# Altium project SVFC.PrjPcb (part 7 of 10)

## Sheet SFPGA_power.SchDoc: System FPGA
size 297 x 209 mm; CheckedBy: T.Janicki; CompanyName: Creotech Instruments SA; DrawnBy: G.Kasprowicz; Organization: CERN; Address1: European Organization for Nuclear Research; Address2: CH-1211 Geneve 23 - Switzerland; DocumentNumber: 9; Revision: -; SheetNumber: 9; SheetTotal: 17; EDA_Number: EDA-xxxx; Projet: Simple VME FMC Carrier; ModifiedBy: TW, MC; CreateDate: 20/11/2012; CheckedDate: 23/01/2012; Title2: Power supplies; DivGrp: BE-CO; Designer: G.Kasprowicz; DocumentName: fpga_power.SchDoc; ModifiedDate: -
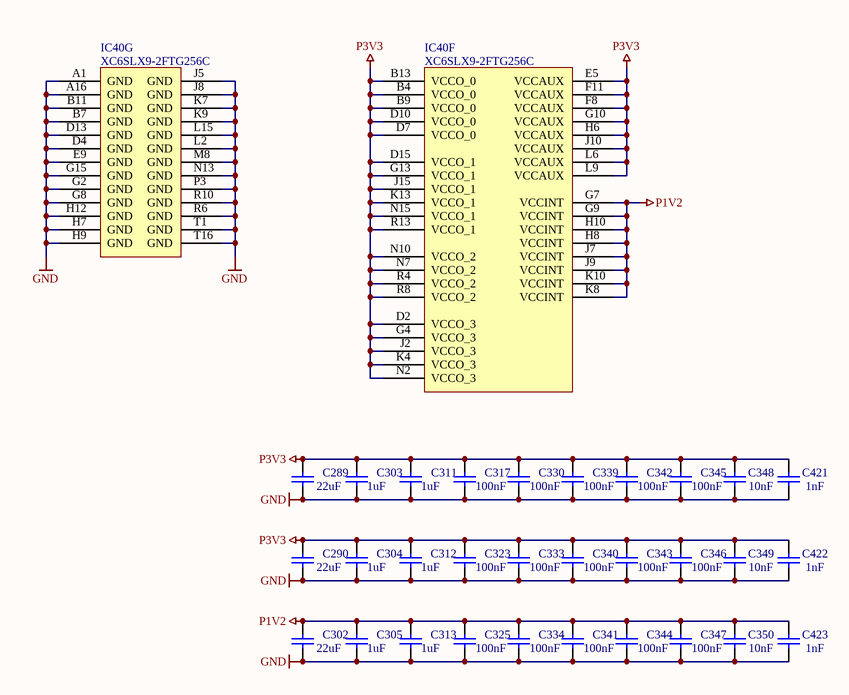
[diagram p14: SFPGA_power.SchDoc]

### Parts
C289  22uF  [CAPC3216X180N]
C290  22uF  [CAPC3216X180N]
C302  22uF  [CAPC3216X180N]
C303  1uF  [CAPC1608X87N]
C304  1uF  [CAPC1608X87N]
C305  1uF  [CAPC1608X87N]
C311  1uF  [CAPC1608X87N]
C312  1uF  [CAPC1608X87N]
C313  1uF  [CAPC1608X87N]
C317  100nF  [CAPC1005X55N]
C323  100nF  [CAPC1005X55N]
C325  100nF  [CAPC1005X55N]
C330  100nF  [CAPC1005X55N]
C333  100nF  [CAPC1005X55N]
C334  100nF  [CAPC1005X55N]
C339  100nF  [CAPC1005X55N]
C340  100nF  [CAPC1005X55N]
C341  100nF  [CAPC1005X55N]
C342  100nF  [CAPC1005X55N]
C343  100nF  [CAPC1005X55N]
C344  100nF  [CAPC1005X55N]
C345  100nF  [CAPC1005X55N]
C346  100nF  [CAPC1005X55N]
C347  100nF  [CAPC1005X55N]
C348  10nF  [CAPC1608X87N]
C349  10nF  [CAPC1608X87N]
C350  10nF  [CAPC1608X87N]
C421  1nF  [CAPC1005X55N]
C422  1nF  [CAPC1005X55N]
C423  1nF  [CAPC1005X55N]
IC40  XC6SLX9-2FTG256C  [BGA256C100P16X16_1700X1700X155]  (parts F,G of 7)

### Nets
GND: C289.1 C290.1 C302.1 C303.1 C304.1 C305.1 C311.1 C312.1 C313.1 C317.1 C323.1 C325.1 C330.1 C333.1 C334.1 C339.1 C340.1 C341.1 C342.1 C343.1 C344.1 C345.1 C346.1 C347.1 C348.1 C349.1 C350.1 C421.1 C422.1 C423.1 IC40.A1(GND) IC40.A16(GND) IC40.B7(GND) IC40.B11(GND) IC40.D4(GND) IC40.D13(GND) IC40.E9(GND) IC40.G2(GND) IC40.G8(GND) IC40.G15(GND) IC40.H7(GND) IC40.H9(GND) IC40.H12(GND) IC40.J5(GND) IC40.J8(GND) IC40.K7(GND) IC40.K9(GND) IC40.L2(GND) IC40.L15(GND) IC40.M8(GND) IC40.N13(GND) IC40.P3(GND) IC40.R6(GND) IC40.R10(GND) IC40.T1(GND) IC40.T16(GND)
P1V2: C302.2 C305.2 C313.2 C325.2 C334.2 C341.2 C344.2 C347.2 C350.2 C423.2 IC40.G7(VCCINT) IC40.G9(VCCINT) IC40.H8(VCCINT) IC40.H10(VCCINT) IC40.J7(VCCINT) IC40.J9(VCCINT) IC40.K8(VCCINT) IC40.K10(VCCINT)
P3V3: C289.2 C290.2 C303.2 C304.2 C311.2 C312.2 C317.2 C323.2 C330.2 C333.2 C339.2 C340.2 C342.2 C343.2 C345.2 C346.2 C348.2 C349.2 C421.2 C422.2 IC40.B4(VCCO_0) IC40.B9(VCCO_0) IC40.B13(VCCO_0) IC40.D2(VCCO_3) IC40.D7(VCCO_0) IC40.D10(VCCO_0) IC40.D15(VCCO_1) IC40.E5(VCCAUX) IC40.F8(VCCAUX) IC40.F11(VCCAUX) IC40.G4(VCCO_3) IC40.G10(VCCAUX) IC40.G13(VCCO_1) IC40.H6(VCCAUX) IC40.J2(VCCO_3) IC40.J10(VCCAUX) IC40.J15(VCCO_1) IC40.K4(VCCO_3) IC40.K13(VCCO_1) IC40.L6(VCCAUX) IC40.L9(VCCAUX) IC40.N2(VCCO_3) IC40.N7(VCCO_2) IC40.N10(VCCO_2) IC40.N15(VCCO_1) IC40.R4(VCCO_2) IC40.R8(VCCO_2) IC40.R13(VCCO_1)

### Notes on the sheet
- Project/Equipment
- Document
- Designer
- Drawn by
- Check.by
- File
- Last Mod.
- Print Date
- Sheet
- Size
- A4
- of
- Rev

### Library data of the parts
C289 C290 C302 = CC1206_22UF_10V_10%_X7R: Non-polarised capacitor; Part Description: SMD Multilayer Chip Ceramic Capacitor; Manufacturer: GENERIC; Manufacturer1 Part Number: GRM31CR71A226KE15L; Voltage: 10V; TC: X7R; Tolerance: ±10%; Table: Capacitors SMD; Part Number: CC1206_22UF_10V_10%_X7R; Component Kind: Standard; Component Type: Standard; Pin Count: 2; Value: 22uF; Status: Preferred; Manufacturer Part Number: CC1206_22UF_10V_10%_X7R; Case: 1206; Mounted: Yes; Socket: No; SMD: Yes; Manufacturer1 Example: MURATA; Manufacturer1 ComponentHeight: 1.8mm; HelpURL: \\cern.ch\dfs\Applications\Altium\Datasheets\CC1206_X7R_MURATA_GRM-HI-CAP.pdf; Author: CERN DEM JLC; CreateDate: 2010-06-08; LatestRevisionDate: 2010-06-08
C303-C305 C311-C313 = CC0603_1UF_16V_10%_X7R: Non-polarised capacitor; Part Description: SMD Multilayer Chip Ceramic Capacitor; Manufacturer: GENERIC; Manufacturer1 Part Number: 223824613663; Voltage: 16V; TC: X7R; Tolerance: ±10%; Table: Capacitors SMD; Part Number: CC0603_1UF_16V_10%_X7R; Component Kind: Standard; Component Type: Standard; Pin Count: 2; Value: 1uF; Status: Preferred; Manufacturer Part Number: CC0603_1uF_16V_10%_X7R; Case: 0603; Mounted: Yes; Socket: No; SMD: Yes; Manufacturer1 Example: PHYCOMP; Manufacturer1 ComponentHeight: 0.87mm; HelpURL: \\cern.ch\dfs\Applications\Altium\Datasheets\CC0805_X5R_PHYCOMP_HC.pdf; Author: CERN DEM JLC; CreateDate: 03/12/2007; LatestRevisionDate: 03/12/2007
C317 C323 C325 C330 C333 C334 C339-C347 = CC0402_100NF_16V_10%_X7R: Non-polarised capacitor; Part Description: SMD Multilayer Chip Ceramic Capacitor; Manufacturer: GENERIC; Manufacturer1 Part Number: 223878715649; Voltage: 16V; TC: X7R; Tolerance: ±10%; Table: Capacitors SMD; Part Number: CC0402_100NF_16V_10%_X7R; Component Kind: Standard; Component Type: Standard; Pin Count: 2; Value: 100nF; Status: Not Recommended; Manufacturer Part Number: CC0402_100NF_16V_10%_X7R; Case: 0402; Mounted: Yes; Socket: No; SMD: Yes; Manufacturer1 Example: PHYCOMP; Manufacturer1 ComponentHeight: 0.55mm; HelpURL: \\cern.ch\dfs\Applications\Altium\Datasheets\CC0402_X7R_PHYCOMP.pdf; Author: CERN DEM JLC; CreateDate: 03/12/2007; LatestRevisionDate: 03/12/2007
C348-C350 = CC0603_10NF_50V_10%_X7R: Non-polarised capacitor; Part Description: SMD Multilayer Chip Ceramic Capacitor; Manufacturer: GENERIC; Manufacturer1 Part Number: 223858615636; Voltage: 50V; TC: X7R; Tolerance: ±10%; Table: Capacitors SMD; Part Number: CC0603_10NF_50V_10%_X7R; Component Kind: Standard; Component Type: Standard; Pin Count: 2; Value: 10nF; Status: Preferred; Manufacturer Part Number: CC0603_10NF_50V_10%_X7R; Case: 0603; Mounted: Yes; Socket: No; SMD: Yes; Manufacturer1 Example: PHYCOMP; Manufacturer1 ComponentHeight: 0.87mm; HelpURL: \\cern.ch\dfs\Applications\Altium\Datasheets\CC0603_X7R_PHYCOMP.pdf; Author: CERN DEM JLC; CreateDate: 03/12/2007; LatestRevisionDate: 03/12/2007
C421-C423 = CC0402_1NF_50V_10%_X7R: Non-polarised capacitor; Part Description: SMD Multilayer Chip Ceramic Capacitor; Manufacturer: GENERIC; Manufacturer1 Part Number: 223858715623; Voltage: 50V; TC: X7R; Tolerance: ±10%; Table: Capacitors SMD; Part Number: CC0402_1NF_50V_10%_X7R; Component Kind: Standard; Component Type: Standard; Pin Count: 2; Value: 1nF; Status: Not Recommended; Manufacturer Part Number: CC0402_1NF_50V_10%_X7R; Case: 0402; Mounted: Yes; Socket: No; SMD: Yes; Manufacturer1 Example: PHYCOMP; Manufacturer1 ComponentHeight: 0.55mm; HelpURL: \\cern.ch\dfs\Applications\Altium\Datasheets\CC0402_X7R_PHYCOMP.pdf; Author: CERN DEM JLC; CreateDate: 03/12/2007; LatestRevisionDate: 03/12/2007
IC40 = XC6SLX9-2FTG256C: Spartan-6 LX 1.2V FPGA, 186 User I/Os, 256-Ball Fine-Pitch Thin BGA (1.0mm Pitch), Speed Grade 2, Commercial Grade, Pb-Free; Manufacturer: XILINX; Table: Logic; Part Number: XC6SLX9-2FTG256C; Component Kind: Standard; Component Type: Standard; Device: XC6SLX9-2FTG256C; PackageDescription: BGA 1mm, Pitch, Square 256 Pin, 16 Columns x 16 Rows, Body 17mm X 17mm X 1.55mm H; Part Description: Spartan-6 LX 1.2V FPGA, 186 User I/Os, 256-Ball Fine-Pitch Thin BGA (1.0mm Pitch), Speed Grade 2, Commercial Grade, Pb-Free; Manufacturer Part Number: XC6SLX9-2FTG256C; Pin Count: 256; Case: BGA256; Mounted: Yes; Socket: No; SMD: Yes; ComponentHeight: 1.55mm; HelpURL: \\cern.ch\dfs\Applications\Altium\Datasheets\XC6SLX9-2FTG256C.pdf; ComponentLink1URL: \\cern.ch\dfs\Applications\Altium\Datasheets\XC6SLX9-2FTG256C_Package-Pinout.pdf; ComponentLink1Description: Package/Pinouts; Author: CERN DEM JLC; CreateDate: 2011-11-01; LatestRevisionDate: 2011-11-01

## Sheet AFPGA_power.SchDoc: Application FPGA
size 297 x 209 mm; CheckedBy: T.Janicki; CompanyName: Creotech Instruments SA; DrawnBy: G.Kasprowicz; Organization: CERN; Address1: European Organization for Nuclear Research; Address2: CH-1211 Geneve 23 - Switzerland; DocumentNumber: 9; Revision: -; SheetNumber: 9; SheetTotal: 17; EDA_Number: EDA-xxxx; Projet: Simple VME FMC Carrier; CreateDate: 20/11/2012; CheckedDate: 23/01/2012; Title2: Power supplies; DivGrp: BE-CO; Designer: G.Kasprowicz; DocumentName: fpga_power.SchDoc; ModifiedDate: -
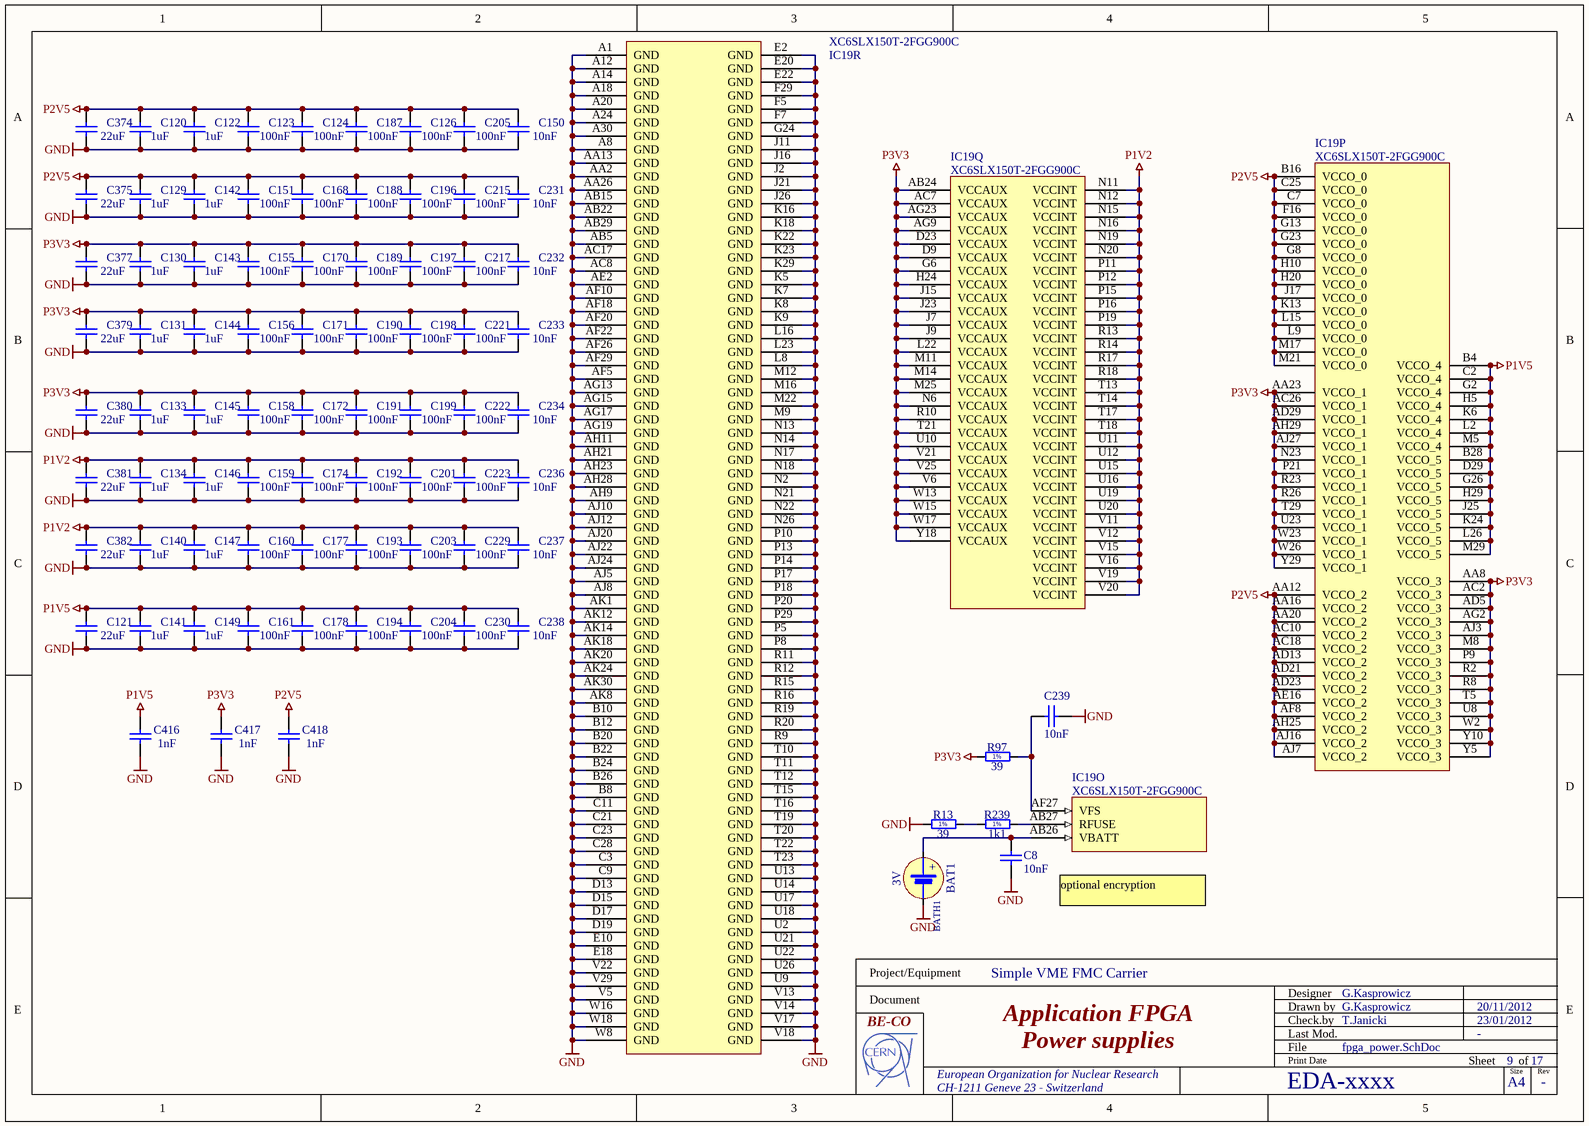
[diagram p15: AFPGA_power.SchDoc]

### Parts
BAT1  3V  [BAT_VARTA_CR2025]
BATH1  (no value)  [BATH_KEYSTONE_103]
C8  10nF  [CAPC1608X87N]
C120  1uF  [CAPC1608X87N]
C121  22uF  [CAPC3216X180N]
C122  1uF  [CAPC1608X87N]
C123  100nF  [CAPC1005X55N]
C124  100nF  [CAPC1005X55N]
C126  100nF  [CAPC1005X55N]
C129  1uF  [CAPC1608X87N]
C130  1uF  [CAPC1608X87N]
C131  1uF  [CAPC1608X87N]
C133  1uF  [CAPC1608X87N]
C134  1uF  [CAPC1608X87N]
C140  1uF  [CAPC1608X87N]
C141  1uF  [CAPC1608X87N]
C142  1uF  [CAPC1608X87N]
C143  1uF  [CAPC1608X87N]
C144  1uF  [CAPC1608X87N]
C145  1uF  [CAPC1608X87N]
C146  1uF  [CAPC1608X87N]
C147  1uF  [CAPC1608X87N]
C149  1uF  [CAPC1608X87N]
C150  10nF  [CAPC1608X87N]
C151  100nF  [CAPC1005X55N]
C155  100nF  [CAPC1005X55N]
C156  100nF  [CAPC1005X55N]
C158  100nF  [CAPC1005X55N]
C159  100nF  [CAPC1005X55N]
C160  100nF  [CAPC1005X55N]
C161  100nF  [CAPC1005X55N]
C168  100nF  [CAPC1005X55N]
C170  100nF  [CAPC1005X55N]
C171  100nF  [CAPC1005X55N]
C172  100nF  [CAPC1005X55N]
C174  100nF  [CAPC1005X55N]
C177  100nF  [CAPC1005X55N]
C178  100nF  [CAPC1005X55N]
C187  100nF  [CAPC1005X55N]
C188  100nF  [CAPC1005X55N]
C189  100nF  [CAPC1005X55N]
C190  100nF  [CAPC1005X55N]
C191  100nF  [CAPC1005X55N]
C192  100nF  [CAPC1005X55N]
C193  100nF  [CAPC1005X55N]
C194  100nF  [CAPC1005X55N]
C196  100nF  [CAPC1005X55N]
C197  100nF  [CAPC1005X55N]
C198  100nF  [CAPC1005X55N]
C199  100nF  [CAPC1005X55N]
C201  100nF  [CAPC1005X55N]
C203  100nF  [CAPC1005X55N]
C204  100nF  [CAPC1005X55N]
C205  100nF  [CAPC1005X55N]
C215  100nF  [CAPC1005X55N]
C217  100nF  [CAPC1005X55N]
C221  100nF  [CAPC1005X55N]
C222  100nF  [CAPC1005X55N]
C223  100nF  [CAPC1005X55N]
C229  100nF  [CAPC1005X55N]
C230  100nF  [CAPC1005X55N]
C231  10nF  [CAPC1608X87N]
C232  10nF  [CAPC1608X87N]
C233  10nF  [CAPC1608X87N]
C234  10nF  [CAPC1608X87N]
C236  10nF  [CAPC1608X87N]
C237  10nF  [CAPC1608X87N]
C238  10nF  [CAPC1608X87N]
C239  10nF  [CAPC1608X87N]
C374  22uF  [CAPC3216X180N]
C375  22uF  [CAPC3216X180N]
C377  22uF  [CAPC3216X180N]
C379  22uF  [CAPC3216X180N]
C380  22uF  [CAPC3216X180N]
C381  22uF  [CAPC3216X180N]
C382  22uF  [CAPC3216X180N]
C416  1nF  [CAPC1005X55N]
C417  1nF  [CAPC1005X55N]
C418  1nF  [CAPC1005X55N]
IC19  XC6SLX150T-2FGG900C  [BGA900C100P30X30_3100X3100X260]  (parts O,P,Q,R of 18)
R13  39  [RESC1608X55N]
R97  39  [RESC1608X55N]
R239  1k1  [RESC1608X55N]

### Nets
GND: BATH1.2(MINUS) C8.2 C120.1 C121.1 C122.1 C123.1 C124.1 C126.1 C129.1 C130.1 C131.1 C133.1 C134.1 C140.1 C141.1 C142.1 C143.1 C144.1 C145.1 C146.1 C147.1 C149.1 C150.1 C151.1 C155.1 C156.1 C158.1 C159.1 C160.1 C161.1 C168.1 C170.1 C171.1 C172.1 C174.1 C177.1 C178.1 C187.1 C188.1 C189.1 C190.1 C191.1 C192.1 C193.1 C194.1 C196.1 C197.1 C198.1 C199.1 C201.1 C203.1 C204.1 C205.1 C215.1 C217.1 C221.1 C222.1 C223.1 C229.1 C230.1 C231.1 C232.1 C233.1 C234.1 C236.1 C237.1 C238.1 C239.1 C374.1 C375.1 C377.1 C379.1 C380.1 C381.1 C382.1 C416.1 C417.1 C418.1 IC19.A1(GND) IC19.A8(GND) IC19.A12(GND) IC19.A14(GND) IC19.A18(GND) IC19.A20(GND) IC19.A24(GND) IC19.A30(GND) IC19.AA2(GND) IC19.AA13(GND) IC19.AA26(GND) IC19.AB5(GND) IC19.AB15(GND) IC19.AB22(GND) IC19.AB29(GND) IC19.AC8(GND) IC19.AC17(GND) IC19.AE2(GND) IC19.AF5(GND) IC19.AF10(GND) IC19.AF18(GND) IC19.AF20(GND) IC19.AF22(GND) IC19.AF26(GND) IC19.AF29(GND) IC19.AG13(GND) IC19.AG15(GND) IC19.AG17(GND) IC19.AG19(GND) IC19.AH9(GND) IC19.AH11(GND) IC19.AH21(GND) IC19.AH23(GND) IC19.AH28(GND) IC19.AJ5(GND) IC19.AJ8(GND) IC19.AJ10(GND) IC19.AJ12(GND) IC19.AJ20(GND) IC19.AJ22(GND) IC19.AJ24(GND) IC19.AK1(GND) IC19.AK8(GND) IC19.AK12(GND) IC19.AK14(GND) IC19.AK18(GND) IC19.AK20(GND) IC19.AK24(GND) IC19.AK30(GND) IC19.B8(GND) IC19.B10(GND) IC19.B12(GND) IC19.B20(GND) IC19.B22(GND) IC19.B24(GND) IC19.B26(GND) IC19.C3(GND) IC19.C9(GND) IC19.C11(GND) IC19.C21(GND) IC19.C23(GND) IC19.C28(GND) IC19.D13(GND) IC19.D15(GND) IC19.D17(GND) IC19.D19(GND) IC19.E2(GND) IC19.E10(GND) IC19.E18(GND) IC19.E20(GND) IC19.E22(GND) IC19.F5(GND) IC19.F7(GND) IC19.F29(GND) IC19.G24(GND) IC19.J2(GND) IC19.J11(GND) IC19.J16(GND) IC19.J21(GND) IC19.J26(GND) IC19.K5(GND) IC19.K7(GND) IC19.K8(GND) IC19.K9(GND) IC19.K16(GND) IC19.K18(GND) IC19.K22(GND) IC19.K23(GND) IC19.K29(GND) IC19.L8(GND) IC19.L16(GND) IC19.L23(GND) IC19.M9(GND) IC19.M12(GND) IC19.M16(GND) IC19.M22(GND) IC19.N2(GND) IC19.N13(GND) IC19.N14(GND) IC19.N17(GND) IC19.N18(GND) IC19.N21(GND) IC19.N22(GND) IC19.N26(GND) IC19.P5(GND) IC19.P8(GND) IC19.P10(GND) IC19.P13(GND) IC19.P14(GND) IC19.P17(GND) IC19.P18(GND) IC19.P20(GND) IC19.P29(GND) IC19.R9(GND) IC19.R11(GND) IC19.R12(GND) IC19.R15(GND) IC19.R16(GND) IC19.R19(GND) IC19.R20(GND) IC19.T10(GND) IC19.T11(GND) IC19.T12(GND) IC19.T15(GND) IC19.T16(GND) IC19.T19(GND) IC19.T20(GND) IC19.T22(GND) IC19.T23(GND) IC19.U2(GND) IC19.U9(GND) IC19.U13(GND) IC19.U14(GND) IC19.U17(GND) IC19.U18(GND) IC19.U21(GND) IC19.U22(GND) IC19.U26(GND) IC19.V5(GND) IC19.V13(GND) IC19.V14(GND) IC19.V17(GND) IC19.V18(GND) IC19.V22(GND) IC19.V29(GND) IC19.W8(GND) IC19.W16(GND) IC19.W18(GND) R13.1
P1V2: C134.2 C140.2 C146.2 C147.2 C159.2 C160.2 C174.2 C177.2 C192.2 C193.2 C201.2 C203.2 C223.2 C229.2 C236.2 C237.2 C381.2 C382.2 IC19.N11(VCCINT) IC19.N12(VCCINT) IC19.N15(VCCINT) IC19.N16(VCCINT) IC19.N19(VCCINT) IC19.N20(VCCINT) IC19.P11(VCCINT) IC19.P12(VCCINT) IC19.P15(VCCINT) IC19.P16(VCCINT) IC19.P19(VCCINT) IC19.R13(VCCINT) IC19.R14(VCCINT) IC19.R17(VCCINT) IC19.R18(VCCINT) IC19.T13(VCCINT) IC19.T14(VCCINT) IC19.T17(VCCINT) IC19.T18(VCCINT) IC19.U11(VCCINT) IC19.U12(VCCINT) IC19.U15(VCCINT) IC19.U16(VCCINT) IC19.U19(VCCINT) IC19.U20(VCCINT) IC19.V11(VCCINT) IC19.V12(VCCINT) IC19.V15(VCCINT) IC19.V16(VCCINT) IC19.V19(VCCINT) IC19.V20(VCCINT)
P1V5: C121.2 C141.2 C149.2 C161.2 C178.2 C194.2 C204.2 C230.2 C238.2 C416.2 IC19.B4(VCCO_4) IC19.B28(VCCO_5) IC19.C2(VCCO_4) IC19.D29(VCCO_5) IC19.G2(VCCO_4) IC19.G26(VCCO_5) IC19.H5(VCCO_4) IC19.H29(VCCO_5) IC19.J25(VCCO_5) IC19.K6(VCCO_4) IC19.K24(VCCO_5) IC19.L2(VCCO_4) IC19.L26(VCCO_5) IC19.M5(VCCO_4) IC19.M29(VCCO_5)
P2V5: C120.2 C122.2 C123.2 C124.2 C126.2 C129.2 C142.2 C150.2 C151.2 C168.2 C187.2 C188.2 C196.2 C205.2 C215.2 C231.2 C374.2 C375.2 C418.2 IC19.AA12(VCCO_2) IC19.AA16(VCCO_2) IC19.AA20(VCCO_2) IC19.AC10(VCCO_2) IC19.AC18(VCCO_2) IC19.AD13(VCCO_2) IC19.AD21(VCCO_2) IC19.AD23(VCCO_2) IC19.AE16(VCCO_2) IC19.AF8(VCCO_2) IC19.AH25(VCCO_2) IC19.AJ7(VCCO_2) IC19.AJ16(VCCO_2) IC19.B16(VCCO_0) IC19.C7(VCCO_0) IC19.C25(VCCO_0) IC19.F16(VCCO_0) IC19.G8(VCCO_0) IC19.G13(VCCO_0) IC19.G23(VCCO_0) IC19.H10(VCCO_0) IC19.H20(VCCO_0) IC19.J17(VCCO_0) IC19.K13(VCCO_0) IC19.L9(VCCO_0) IC19.L15(VCCO_0) IC19.M17(VCCO_0) IC19.M21(VCCO_0)
P3V3: C130.2 C131.2 C133.2 C143.2 C144.2 C145.2 C155.2 C156.2 C158.2 C170.2 C171.2 C172.2 C189.2 C190.2 C191.2 C197.2 C198.2 C199.2 C217.2 C221.2 C222.2 C232.2 C233.2 C234.2 C377.2 C379.2 C380.2 C417.2 IC19.AA8(VCCO_3) IC19.AA23(VCCO_1) IC19.AB24(VCCAUX) IC19.AC2(VCCO_3) IC19.AC7(VCCAUX) IC19.AC26(VCCO_1) IC19.AD5(VCCO_3) IC19.AD29(VCCO_1) IC19.AG2(VCCO_3) IC19.AG9(VCCAUX) IC19.AG23(VCCAUX) IC19.AH29(VCCO_1) IC19.AJ3(VCCO_3) IC19.AJ27(VCCO_1) IC19.D9(VCCAUX) IC19.D23(VCCAUX) IC19.G6(VCCAUX) IC19.H24(VCCAUX) IC19.J7(VCCAUX) IC19.J9(VCCAUX) IC19.J15(VCCAUX) IC19.J23(VCCAUX) IC19.L22(VCCAUX) IC19.M8(VCCO_3) IC19.M11(VCCAUX) IC19.M14(VCCAUX) IC19.M25(VCCAUX) IC19.N6(VCCAUX) IC19.N23(VCCO_1) IC19.P9(VCCO_3) IC19.P21(VCCO_1) IC19.R2(VCCO_3) IC19.R8(VCCO_3) IC19.R10(VCCAUX) IC19.R23(VCCO_1) IC19.R26(VCCO_1) IC19.T5(VCCO_3) IC19.T21(VCCAUX) IC19.T29(VCCO_1) IC19.U8(VCCO_3) IC19.U10(VCCAUX) IC19.U23(VCCO_1) IC19.V6(VCCAUX) IC19.V21(VCCAUX) IC19.V25(VCCAUX) IC19.W2(VCCO_3) IC19.W13(VCCAUX) IC19.W15(VCCAUX) IC19.W17(VCCAUX) IC19.W23(VCCO_1) IC19.W26(VCCO_1) IC19.Y5(VCCO_3) IC19.Y10(VCCO_3) IC19.Y18(VCCAUX) IC19.Y29(VCCO_1) R97.1
NetBATH1_1: BATH1.1(PLUS) C8.1 IC19.AB26(VBATT)
NetC239_2: C239.2 IC19.AF27(VFS) R97.2
NetIC19_AB27: IC19.AB27(RFUSE) R239.2
NetR13_2: R13.2 R239.1

### Notes on the sheet
- optional encryption
- Project/Equipment
- Document
- Designer
- Drawn by
- Check.by
- File
- Last Mod.
- Print Date
- Sheet
- Size
- A4
- of
- Rev
- (in symbol BAT_VARTA_CR2025) +
- (in symbol BATH_KEYSTONE_103) +
- (in symbol R0603_1K1_1%_0.1W_100PPM) 1%
- (in symbol R0603_39R_1%_0.1W_100PPM) 1%

### Library data of the parts
BAT1 = BAT_VARTA_CR2025: Battery for use only with Socket Holder; Part Description: 20x2.5mm Lithium Coin Cells Type CR2025; Manufacturer: VARTA; Manufacturer Part Number: 6025101501; Power: 165mAh; Table: Batteries; Part Number: BAT_VARTA_CR2025; Component Kind: Standard; Component Type: Standard; Pin Count: 0; PackageDescription: CR2025, 20mm Diameter x 2.5mm  Height Lithium Coin Cells; Family: Battery; Mounted: Yes; Socket: Yes; SMD: No; Value: 3V; ComponentHeight: 2.5mm; HelpURL: \\cern.ch\dfs\Applications\Altium\Datasheets\BAT_VARTA_CR2025.pdf; Author: CERN DEM JLC; CreateDate: 2009-10-20; LatestRevisionDate: 2009-10-20
BATH1 = BATH_KEYSTONE_103: Battery Holder whit 2 Pin; Part Description: Battery Holders for 20mm Lithium Coin Cells; Manufacturer Part Number: 103; Table: Batteries; Part Number: BATH_KEYSTONE_103; Component Kind: Standard; Component Type: Standard; Pin Count: 2; PackageDescription: Battery Holders for 20mm Lithium Coin Cells; Family: Battery; Mounted: Yes; Socket: No; SMD: No; Manufacturer: KEYSTONE; ComponentHeight: 8.5mm; HelpURL: \\cern.ch\dfs\Applications\Altium\Datasheets\BATH_KEYSTONE_103.pdf; Author: CERN DEM JLC; CreateDate: 2009-10-20; LatestRevisionDate: 2009-10-20
C8 C150 C231-C234 C236-C239 = CC0603_10NF_50V_10%_X7R: as C348-C350 on sheet SFPGA_power; Part Number: CC0603_10NF_50V_10%_X7R; Component Kind: Standard; Component Type: Standard; Pin Count: 2; Value: 10nF; Status: Preferred; Manufacturer Part Number: CC0603_10NF_50V_10%_X7R; Case: 0603; Mounted: Yes; Socket: No; SMD: Yes; Manufacturer1 Example: PHYCOMP; Manufacturer1 ComponentHeight: 0.87mm; HelpURL: \\cern.ch\dfs\Applications\Altium\Datasheets\CC0603_X7R_PHYCOMP.pdf; Author: CERN DEM JLC; CreateDate: 03/12/2007; LatestRevisionDate: 03/12/2007
C120 C122 C129-C131 C133 C134 C140-C147 C149 = CC0603_1UF_16V_10%_X7R: as C303-C305 on sheet SFPGA_power; Part Number: CC0603_1UF_16V_10%_X7R; Component Kind: Standard; Component Type: Standard; Pin Count: 2; Value: 1uF; Status: Preferred; Manufacturer Part Number: CC0603_1uF_16V_10%_X7R; Case: 0603; Mounted: Yes; Socket: No; SMD: Yes; Manufacturer1 Example: PHYCOMP; Manufacturer1 ComponentHeight: 0.87mm; HelpURL: \\cern.ch\dfs\Applications\Altium\Datasheets\CC0805_X5R_PHYCOMP_HC.pdf; Author: CERN DEM JLC; CreateDate: 03/12/2007; LatestRevisionDate: 03/12/2007
C121 C374 C375 C377 C379-C382 = CC1206_22UF_10V_10%_X7R: as C289 on sheet SFPGA_power; Part Number: CC1206_22UF_10V_10%_X7R; Component Kind: Standard; Component Type: Standard; Pin Count: 2; Value: 22uF; Status: Preferred; Manufacturer Part Number: CC1206_22UF_10V_10%_X7R; Case: 1206; Mounted: Yes; Socket: No; SMD: Yes; Manufacturer1 Example: MURATA; Manufacturer1 ComponentHeight: 1.8mm; HelpURL: \\cern.ch\dfs\Applications\Altium\Datasheets\CC1206_X7R_MURATA_GRM-HI-CAP.pdf; Author: CERN DEM JLC; CreateDate: 2010-06-08; LatestRevisionDate: 2010-06-08
C123 C124 C126 C151 C155 C156 C158-C161 C168 C170-C172 C174 C177 C178 C187-C194 C196-C199 C201 C203-C205 C215 C217 C221-C223 C229 C230 = CC0402_100NF_16V_10%_X7R: as C317 on sheet SFPGA_power; Part Number: CC0402_100NF_16V_10%_X7R; Component Kind: Standard; Component Type: Standard; Pin Count: 2; Value: 100nF; Status: Not Recommended; Manufacturer Part Number: CC0402_100NF_16V_10%_X7R; Case: 0402; Mounted: Yes; Socket: No; SMD: Yes; Manufacturer1 Example: PHYCOMP; Manufacturer1 ComponentHeight: 0.55mm; HelpURL: \\cern.ch\dfs\Applications\Altium\Datasheets\CC0402_X7R_PHYCOMP.pdf; Author: CERN DEM JLC; CreateDate: 03/12/2007; LatestRevisionDate: 03/12/2007
C416-C418 = CC0402_1NF_50V_10%_X7R: as C421-C423 on sheet SFPGA_power; Part Number: CC0402_1NF_50V_10%_X7R; Component Kind: Standard; Component Type: Standard; Pin Count: 2; Value: 1nF; Status: Not Recommended; Manufacturer Part Number: CC0402_1NF_50V_10%_X7R; Case: 0402; Mounted: Yes; Socket: No; SMD: Yes; Manufacturer1 Example: PHYCOMP; Manufacturer1 ComponentHeight: 0.55mm; HelpURL: \\cern.ch\dfs\Applications\Altium\Datasheets\CC0402_X7R_PHYCOMP.pdf; Author: CERN DEM JLC; CreateDate: 03/12/2007; LatestRevisionDate: 03/12/2007
IC19 = XC6SLX150T-2FGG900C: SPARTAN-6, FPGA, 900-Ball BGA, Commercial Grade, Pb-Free; Part Description: SPARTAN-6, FPGA, 540 User I/Os, 8 GTPs, 900-Ball BGA, Commercial Grade, Pb-Free; Manufacturer: XILINX; Table: Logic; Part Number: XC6SLX150T-2FGG900C; Component Kind: Standard; Component Type: Standard; Device: XC6SLX150T-2FGG900C; PackageDescription: BGA,1.00mm pitch, square; 900 pin, 30 columns X 30 rows, 31.00mm X 31.00mm X 2.60mm H, IPC Medium Density; Manufacturer Part Number: XC6SLX150T-2FGG900C; Pin Count: 900; Case: BGA900; Mounted: Yes; Socket: No; SMD: Yes; ComponentHeight: 2.6mm; HelpURL: \\cern.ch\dfs\Applications\Altium\Datasheets\XC6SLX150T-2FGG900C.pdf; ComponentLink1URL: \\cern.ch\dfs\Applications\Altium\Datasheets\XC6SLX150T-2FGG900C_Package-Pinouts.pdf; ComponentLink1Description: Package/Pinouts; Author: CERN DEM JLC; CreateDate: 2009-11-17; LatestRevisionDate: 2009-11-17
R13 R97 = R0603_39R_1%_0.1W_100PPM: Resistor - 1%; Part Description: General Purpose Thick Film Chip Resistor; Manufacturer: GENERIC; Manufacturer1 Part Number: NRC06F39R0TRF; Power: 0.1W; TC: ±100ppm/°C; Table: Resistors SMD; Part Number: R0603_39R_1%_0.1W_100PPM; Component Kind: Standard; Component Type: Standard; Pin Count: 2; Value: 39; Status: Preferred; Tolerance: ±1%; Manufacturer Part Number: R0603_39R_1%_0.1W_100PPM; Case: 0603; Mounted: Yes; Socket: No; SMD: Yes; Manufacturer1 Example: NIC COMPONENT; Manufacturer1 ComponentHeight: 0.55mm; HelpURL: \\cern.ch\dfs\Applications\Altium\Datasheets\R0603_NIC_NRC.pdf; Author: CERN DEM JLC; CreateDate: 2007-12-03; LatestRevisionDate: 2008-03-13
R239 = R0603_1K1_1%_0.1W_100PPM: Resistor - 1%; Part Description: General Purpose Thick Film Chip Resistor; Manufacturer: GENERIC; Manufacturer1 Part Number: NRC06F1101TRF; Power: 0.1W; TC: ±100ppm/°C; Table: Resistors SMD; Part Number: R0603_1K1_1%_0.1W_100PPM; Component Kind: Standard; Component Type: Standard; Pin Count: 2; Value: 1k1; Status: Preferred; Tolerance: ±1%; Manufacturer Part Number: R0603_1K1_1%_0.1W_100PPM; Case: 0603; Mounted: Yes; Socket: No; SMD: Yes; Manufacturer1 Example: NIC COMPONENT; Manufacturer1 ComponentHeight: 0.55mm; HelpURL: \\cern.ch\dfs\Applications\Altium\Datasheets\R0603_NIC_NRC.pdf; Author: CERN DEM JLC; CreateDate: 2007-12-03; LatestRevisionDate: 2008-03-13

## Sheet USB.SchDoc: USB-UART & FIFO bridge
size A3; CheckedBy: T.Janicki; CompanyName: Creotech Instruments SA; DrawnBy: Greg Kasprowicz; Organization: CERN; Address1: European Organization for Nuclear Research; Address2: CH-1211 Genève 23 - Switzerland; DocumentNumber: 17; Revision: -; SheetNumber: 17; SheetTotal: 17; EDA_Number: EDA-xxxx; Projet: Simple VME FMC Carrier; CreateDate: 20/11/2012; CheckedDate: 23/01/2012; DivGrp: BE-CO; Designer: G.Kasprowicz; ModifiedDate: -
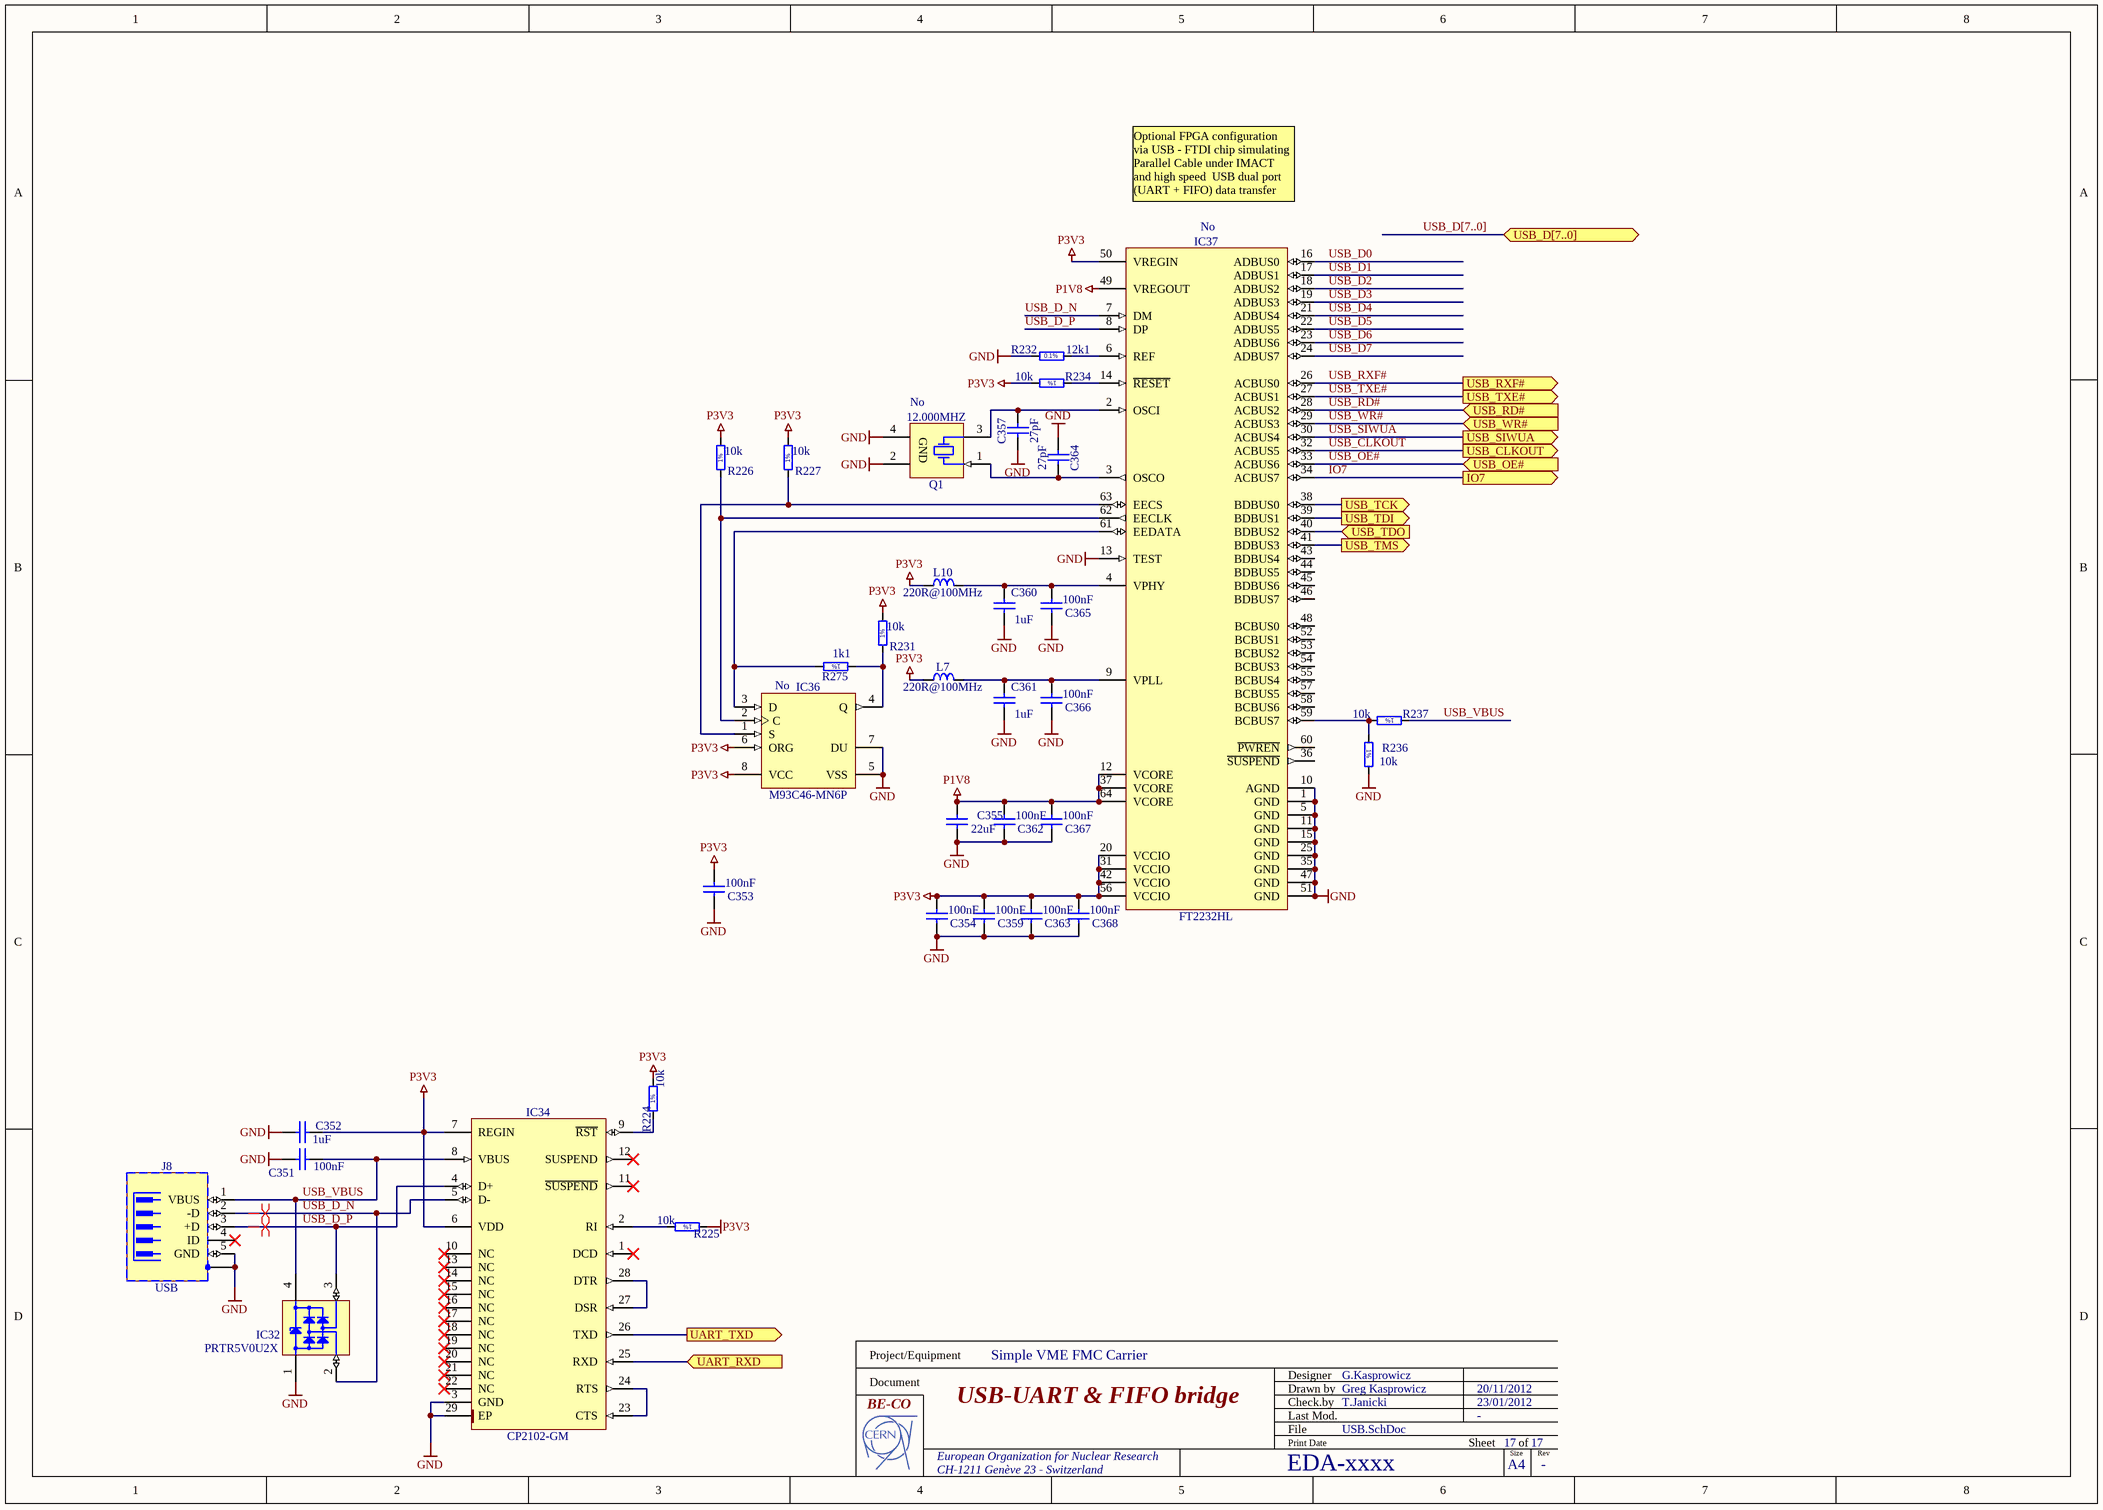
[diagram p16: USB.SchDoc]

### Parts
C351  100nF  [CAPC1005X55N]
C352  1uF  [CAPC1608X87N]
C353  100nF  [CAPC1005X55N]
C354  100nF  [CAPC1005X55N]
C355  22uF  [CAPC3216X180N]
C357  27pF  [CAPC1608X87N]
C359  100nF  [CAPC1005X55N]
C360  1uF  [CAPC1608X87N]
C361  1uF  [CAPC1608X87N]
C362  100nF  [CAPC1005X55N]
C363  100nF  [CAPC1005X55N]
C364  27pF  [CAPC1608X87N]
C365  100nF  [CAPC1005X55N]
C366  100nF  [CAPC1005X55N]
C367  100nF  [CAPC1005X55N]
C368  100nF  [CAPC1005X55N]
IC32  PRTR5V0U2X  [SOT190P230X110-4N]
IC34  CP2102-GM  [QFN50P500X500X100-29N-S335]
IC36  M93C46-MN6P  Mounted: No  [SOIC127P600X175-8N]
IC37  FT2232HL  Mounted: No  [QFP50P1200X1200X160-64N]
J8  USB  [TYCO_1734035-1]
L7  220R@100MHz  [INDC2012X105N]
L10  220R@100MHz  [INDC2012X105N]
Q1  12.000MHZ  Mounted: No  [XTAL_ABRACON_ABM3B]
R224  10k  [RESC1608X55N]
R225  10k  [RESC1608X55N]
R226  10k  [RESC1608X55N]
R227  10k  [RESC1608X55N]
R231  10k  [RESC1608X55N]
R232  12k1  [RESC1608X55N]
R234  10k  [RESC1608X55N]
R236  10k  [RESC1608X55N]
R237  10k  [RESC1608X55N]
R275  1k1  [RESC1608X55N]

### Ports
IO7 (out), UART_RXD (in), UART_TXD (out), USB_CLKOUT (out), USB_D[7..0] (bidir), USB_OE# (in), USB_RD# (in), USB_RXF# (out), USB_SIWUA (out), USB_TCK (out), USB_TDI (out), USB_TDO (in), USB_TMS (out), USB_TXE# (out), USB_WR# (in)

### Nets
GND: C351.2 C352.2 C353.2 C354.2 C355.1 C357.1 C359.2 C360.1 C361.1 C362.2 C363.2 C364.1 C365.2 C366.2 C367.2 C368.2 IC32.1(GND) IC34.3(GND) IC34.29(EP) IC36.5(VSS) IC36.7(DU) IC37.1(GND) IC37.5(GND) IC37.10(AGND) IC37.11(GND) IC37.13(TEST) IC37.15(GND) IC37.25(GND) IC37.35(GND) IC37.47(GND) IC37.51(GND) J8.5(GND) J8.6(SH) Q1.2(GND) Q1.4(GND) R232.1 R236.2
P1V8: C355.2 C362.1 C367.1 IC37.12(VCORE) IC37.37(VCORE) IC37.49(VREGOUT) IC37.64(VCORE)
P3V3: C352.1 C353.1 C354.1 C359.1 C363.1 C368.1 IC34.6(VDD) IC34.7(REGIN) IC36.6(ORG) IC36.8(VCC) IC37.20(VCCIO) IC37.31(VCCIO) IC37.42(VCCIO) IC37.50(VREGIN) IC37.56(VCCIO) L7.1 L10.1 R224.2 R225.1 R226.2 R227.2 R231.2 R234.2
IO7: IC37.34(ACBUS7) ; port IO7
UART_RXD: IC34.25(RXD) ; port UART_RXD
UART_TXD: IC34.26(TXD) ; port UART_TXD
USB_CLKOUT: IC37.32(ACBUS5) ; port USB_CLKOUT
USB_D0: IC37.16(ADBUS0)
USB_D1: IC37.17(ADBUS1)
USB_D2: IC37.18(ADBUS2)
USB_D3: IC37.19(ADBUS3)
USB_D4: IC37.21(ADBUS4)
USB_D5: IC37.22(ADBUS5)
USB_D6: IC37.23(ADBUS6)
USB_D7: IC37.24(ADBUS7)
USB_D_N: IC32.2(I/O1) IC34.5(D-) IC37.7(DM) J8.2(-D)
USB_D_P: IC32.3(I/O2) IC34.4(D+) IC37.8(DP) J8.3(+D)
USB_OE#: IC37.33(ACBUS6) ; port USB_OE#
USB_RD#: IC37.28(ACBUS2) ; port USB_RD#
USB_RXF#: IC37.26(ACBUS0) ; port USB_RXF#
USB_SIWUA: IC37.30(ACBUS4) ; port USB_SIWUA
USB_TCK: IC37.38(BDBUS0) ; port USB_TCK
USB_TDI: IC37.39(BDBUS1) ; port USB_TDI
USB_TDO: IC37.40(BDBUS2) ; port USB_TDO
USB_TMS: IC37.41(BDBUS3) ; port USB_TMS
USB_TXE#: IC37.27(ACBUS1) ; port USB_TXE#
USB_VBUS: C351.1 IC32.4(VCC) IC34.8(VBUS) J8.1(VBUS) R237.1
USB_WR#: IC37.29(ACBUS3) ; port USB_WR#
NetC357_2: C357.2 IC37.2(OSCI) Q1.3(X)
NetC360_2: C360.2 C365.1 IC37.4(VPHY) L10.2
NetC361_2: C361.2 C366.1 IC37.9(VPLL) L7.2
NetC364_2: C364.2 IC37.3(OSCO) Q1.1(X)
NetIC34_2: IC34.2(RI) R225.2
NetIC34_9: IC34.9(~{RST}) R224.1
NetIC34_23: IC34.23(CTS) IC34.24(RTS)
NetIC34_27: IC34.27(DSR) IC34.28(DTR)
NetIC36_1: IC36.1(S) IC37.63(EECS) R227.1
NetIC36_2: IC36.2(C) IC37.62(EECLK) R226.1
NetIC36_3: IC36.3(D) IC37.61(EEDATA) R275.2
NetIC36_4: IC36.4(Q) R231.1 R275.1
NetIC37_6: IC37.6(REF) R232.2
NetIC37_14: IC37.14(~{RESET}) R234.1
NetIC37_59: IC37.59(BCBUS7) R236.1 R237.2

Not connected (* = marked no-connect by the designer): IC34 1(DCD)* 10(NC)* 11(~{SUSPEND})* 12(SUSPEND)* 13(NC)* 14(NC)* 15(NC)* 16(NC)* 17(NC)* 18(NC)* 19(NC)* 20(NC)* 21(NC)* 22(NC)*; IC37 36(~{SUSPEND}) 43(BDBUS4) 44(BDBUS5) 45(BDBUS6) 46(BDBUS7) 48(BCBUS0) 52(BCBUS1) 53(BCBUS2) 54(BCBUS3) 55(BCBUS4) 57(BCBUS5) 58(BCBUS6) 60(~{PWREN}); J8 4(ID)*

### Buses and harness runs
bus USB_D[7..0] = port USB_D[7..0]

### Layout directives
differential pair: USB_D_N, USB_D_P

### Notes on the sheet
- Optional FPGA configuration via USB - FTDI chip simulating Parallel Cable under IMACT and high speed  USB dual port (UART + FIFO) data transfer port
- Project/Equipment
- Document
- Designer
- Drawn by
- Check.by
- File
- Last Mod.
- Print Date
- Sheet
- Size
- A4
- of
- Rev
- (in symbol R0603_1K1_1%_0.1W_100PPM) 1%
- (in symbol R0603_10K_1%_0.1W_100PPM) 1%
- (in symbol R0603_12K1_0.1%_0.063W_10PPM) 0.1%

### Library data of the parts
C351 C353 C354 C359 C362 C363 C365-C368 = CC0402_100NF_16V_10%_X7R: as C317 on sheet SFPGA_power; Part Number: CC0402_100NF_16V_10%_X7R; Component Kind: Standard; Component Type: Standard; Pin Count: 2; Value: 100nF; Status: Not Recommended; Manufacturer Part Number: CC0402_100NF_16V_10%_X7R; Case: 0402; Mounted: Yes; Socket: No; SMD: Yes; Manufacturer1 Example: PHYCOMP; Manufacturer1 ComponentHeight: 0.55mm; HelpURL: \\cern.ch\dfs\Applications\Altium\Datasheets\CC0402_X7R_PHYCOMP.pdf; Author: CERN DEM JLC; CreateDate: 03/12/2007; LatestRevisionDate: 03/12/2007
C352 C360 C361 = CC0603_1UF_16V_10%_X7R: as C303-C305 on sheet SFPGA_power; Part Number: CC0603_1UF_16V_10%_X7R; Component Kind: Standard; Component Type: Standard; Pin Count: 2; Value: 1uF; Status: Preferred; Manufacturer Part Number: CC0603_1uF_16V_10%_X7R; Case: 0603; Mounted: Yes; Socket: No; SMD: Yes; Manufacturer1 Example: PHYCOMP; Manufacturer1 ComponentHeight: 0.87mm; HelpURL: \\cern.ch\dfs\Applications\Altium\Datasheets\CC0805_X5R_PHYCOMP_HC.pdf; Author: CERN DEM JLC
  C352: CreateDate: 12/3/2007; LatestRevisionDate: 12/3/2007
  C360 C361: CreateDate: 03/12/2007; LatestRevisionDate: 03/12/2007
C355 = CC1206_22UF_10V_10%_X7R: as C289 on sheet SFPGA_power; Part Number: CC1206_22UF_10V_10%_X7R; Component Kind: Standard; Component Type: Standard; Pin Count: 2; Value: 22uF; Status: Preferred; Manufacturer Part Number: CC1206_22UF_10V_10%_X7R; Case: 1206; Mounted: Yes; Socket: No; SMD: Yes; Manufacturer1 Example: MURATA; Manufacturer1 ComponentHeight: 1.8mm; HelpURL: \\cern.ch\dfs\Applications\Altium\Datasheets\CC1206_X7R_MURATA_GRM-HI-CAP.pdf; Author: CERN DEM JLC; CreateDate: 2010-06-08; LatestRevisionDate: 2010-06-08
C357 C364 = CC0603_27PF_50V_5%_NP0: Non-polarised capacitor; Part Description: SMD Multilayer Chip Ceramic Capacitor; Manufacturer: GENERIC; Manufacturer1 Part Number: 223886715279; Voltage: 50V; TC: NP0; Tolerance: ±5%; Table: Capacitors SMD; Part Number: CC0603_27PF_50V_5%_NP0; Component Kind: Standard; Component Type: Standard; Pin Count: 2; Value: 27pF; Status: Preferred; Manufacturer Part Number: CC0603_27PF_50V_5%_NP0; Case: 0603; Mounted: Yes; Socket: No; SMD: Yes; Manufacturer1 Example: PHYCOMP; Manufacturer1 ComponentHeight: 0.87mm; HelpURL: \\cern.ch\dfs\Applications\Altium\Datasheets\CC0603_NP0_PHYCOMP.pdf; Author: CERN DEM JLC; CreateDate: 2007-12-03; LatestRevisionDate: 2007-12-03
IC32 = PRTR5V0U2X: Ultra Low Capacitance Double Rail-to-Rail ESD Protection Diode; Part Description: Ultra Low Capacitance (1pF) Double Rail-to-Rail ESD Protection Diode (8kV); Manufacturer: PHILIPS NXP; Voltage: 5.5V; Table: Diodes; Part Number: PRTR5V0U2X; Component Kind: Standard; Component Type: Standard; Device: PRTR5V0U2X; PackageDescription: SOT143B, SOT, 1.90mm Pitch; 4 Pin, 1.30mm W X 2.90mm L X 1.10mm H body, IPC Medium Density; Manufacturer Part Number: PRTR5V0U2X; Pin Count: 4; Case: SOT143B; Mounted: Yes; Socket: No; SMD: Yes; ComponentHeight: 1.1mm; HelpURL: \\cern.ch\dfs\Applications\Altium\Datasheets\PRTR5V0U2X.pdf; Author: CERN DEM JLC; CreateDate: 3/22/2011; LatestRevisionDate: 3/22/2011
IC34 = CP2102-GM: Single-Chip USB to UART Bridge; Manufacturer: SILICON LABS; Table: Analog & Interface; Part Number: CP2102-GM; Component Kind: Standard; Component Type: Standard; Device: CP2102-GM; PackageDescription: QFN, 0.50mm Pitch, Square; 28 pin, 5.00mm L X 5.00mm W X 1.00mm H body (w/thermal tab 3.35 X 3.35mm),  IPC Medium Density; Part Description: Single-Chip USB to UART Bridge; Manufacturer Part Number: CP2102-GM; Pin Count: 29; Case: QFN28; Mounted: Yes; Socket: No; SMD: Yes; ComponentHeight: 1.0mm; Author: CERN DEM JLC; HelpURL: \\cern.ch\dfs\Applications\Altium\Datasheets\CP2102-GM.pdf; CreateDate: 3/3/2011; LatestRevisionDate: 3/3/2011
IC36 = M93C46-MN6P: 1Kb (x8/x16) Serial Microwire Bus EEPROM; Part Description: 1K (128 x 8 or 64 x 16 bit) Serial Microwire Bus EEPROM; Manufacturer: ST MICROELECTRONICS; Table: Logic; Part Number: M93C46-MN6P; Component Kind: Standard; Component Type: Standard; Device: M93C46-MN6P; PackageDescription: SOIC 8, Pitch 1.27mm - Body 4x5mm, IPC Medium Density; Manufacturer Part Number: M93C46-MN6P; Pin Count: 8; Case: SOIC8; Socket: No; SMD: Yes; ComponentHeight: 1.75mm; HelpURL: \\cern.ch\dfs\Applications\Altium\Datasheets\M93C46-MN6P.pdf; Author: CERN DEM JLC; CreateDate: 2008-09-09; LatestRevisionDate: 2008-09-09
IC37 = FT2232HL: Dual High Speed USB to Multipurpose UART/FIFO IC; Manufacturer: FUTURE TECHNOLOGY DEVICES INTERNATIONAL (FTDI); Table: Analog & Interface; Part Number: FT2232HL; Component Kind: Standard; Component Type: Standard; Device: FT2232HL; PackageDescription: QFP, 0.50mm pitch, square; 16 pin X 16 pin, 10.00mm X 10.00mm X 1.60mm Body, IPC Medium Density; Part Description: Dual High Speed USB to Multipurpose UART/FIFO IC; Manufacturer Part Number: FT2232HL; Pin Count: 64; Case: QFP64; Socket: No; SMD: Yes; ComponentHeight: 1.6mm; Author: CERN DEM JLC; HelpURL: \\cern.ch\dfs\Applications\Altium\Datasheets\FT2232HL.pdf; CreateDate: 2011-12-06; LatestRevisionDate: 2011-12-06
J8 = TYCO_1734035-1: 5 Pin + 1 Shield USB Receptacle; Part Description: 5 Position, Right Angle, SMD Mini USB Type B Receptacle; Manufacturer: TYCO ELECTRONICS; Table: TYCO; Part Number: TYCO_1734035-1; Component Kind: Standard; Component Type: Standard; Pin Count: 6; Family: USB; Mounted: Yes; Socket: No; SMD: Yes; Status: None; Manufacturer Part Number: 1734035-1; ComponentHeight: 3.95mm; HelpURL: \\cern.ch\dfs\Applications\Altium\Datasheets\TYCO_1734035-1.pdf; Author: CERN DEM JLC; CreateDate: 02/05/2011; LatestRevisionDate: 02/05/2011
L7 L10 = IND0805_MURATA_BLM21PG221SN1D: Inductor; Part Description: SMD EMIFIL Suppression Chip Bead Ferrite; Manufacturer: MURATA; Power: 2A; Resistance: 0.05R; Tolerance: ±25%; Table: Inductors SMD; Part Number: IND0805_MURATA_BLM21PG221SN1D; Component Kind: Standard; Component Type: Standard; Pin Count: 2; Value: 220R@100MHz; Status: None; Manufacturer Part Number: BLM21PG221SN1D; Case: 0805; Mounted: Yes; Socket: No; SMD: Yes; ComponentHeight: 1.05mm; HelpURL: \\cern.ch\dfs\Applications\Altium\Datasheets\IND0402_MURATA_BLM21P.pdf; Author: CERN DEM JLC; CreateDate: 25/01/2010; LatestRevisionDate: 25/01/2010
Q1 = XTAL_18.432MHZ_ABRACON_ABM3B-18.432MHZ-B2-T: Crystal 4 pins 1=XTAL Control 2=GND3=XTAL 4=GND; Part Number: XTAL_12.000MHZ_ABRACON_ABM3B-12.000MHZ-B2-T; Part Description: Tolerance:± 20ppm, Stability:± 50ppm, -20°C to +70°C, 18pF, Ceramic SMD Crystal, ABM3B Serie; Manufacturer Part Number: ABM3B-12.000MHZ-B2-T; Table: Crystals & Oscillators; Component Kind: Standard; Component Type: Standard; PackageDescription: ABM3B Serie, SMD Cristal, Body 5.x3.2mm; Value: 12.000MHZ; Manufacturer: ABRACON; Pin Count: 2; Socket: No; SMD: Yes; ComponentHeight: 1.1mm; HelpURL: \\cern.ch\dfs\Applications\Altium\Datasheets\XTAL_ABRACON_ABM3B.pdf; Author: CERN DEM JLC; CreateDate: 2012-01-09; LatestRevisionDate: 2012-01-09
R224-R227 R231 R234 R236 R237 = R0603_10K_1%_0.1W_100PPM: Resistor - 1%; Part Description: General Purpose Thick Film Chip Resistor; Manufacturer: GENERIC; Manufacturer1 Part Number: NRC06F1002TRF; Power: 0.1W; TC: ±100ppm/°C; Table: Resistors SMD; Part Number: R0603_10K_1%_0.1W_100PPM; Component Kind: Standard; Component Type: Standard; Pin Count: 2; Value: 10k; Status: Preferred; Tolerance: ±1%; Manufacturer Part Number: R0603_10K_1%_0.1W_100PPM; Case: 0603; Mounted: Yes; Socket: No; SMD: Yes; Manufacturer1 Example: NIC COMPONENT; Manufacturer1 ComponentHeight: 0.55mm; HelpURL: \\cern.ch\dfs\Applications\Altium\Datasheets\R0603_NIC_NRC.pdf; Author: CERN DEM JLC; CreateDate: 12/3/2007; LatestRevisionDate: 3/13/2008
R232 = R0603_12K1_0.1%_0.063W_10PPM: Resistor - 0.1%; Part Description: Thin Film Chip Resistor; Manufacturer: GENERIC; Manufacturer1 Part Number: RN73C1J12K1BTDF; Power: 0.063W; TC: ±10ppm; Table: Resistors SMD; Part Number: R0603_12K1_0.1%_0.063W_10PPM; Component Kind: Standard; Component Type: Standard; Pin Count: 2; Value: 12k1; Status: Not recommended; Tolerance: ±0.1%; Manufacturer Part Number: R0603_12K1_0.1%_0.063W_10PPM; Case: 0603; Mounted: Yes; Socket: No; SMD: Yes; Manufacturer1 Example: TYCO HOLSWORTHY; Manufacturer1 ComponentHeight: 0.5mm; HelpURL: \\cern.ch\dfs\Applications\Altium\Datasheets\R0603_Tyco_RN73.pdf; Author: CERN DEM JLC; CreateDate: 2007-12-03; LatestRevisionDate: 2008-03-13
R275 = R0603_1K1_1%_0.1W_100PPM: as R239 on sheet AFPGA_power; Part Number: R0603_1K1_1%_0.1W_100PPM; Component Kind: Standard; Component Type: Standard; Pin Count: 2; Value: 1k1; Status: Preferred; Tolerance: ±1%; Manufacturer Part Number: R0603_1K1_1%_0.1W_100PPM; Case: 0603; Mounted: Yes; Socket: No; SMD: Yes; Manufacturer1 Example: NIC COMPONENT; Manufacturer1 ComponentHeight: 0.55mm; HelpURL: \\cern.ch\dfs\Applications\Altium\Datasheets\R0603_NIC_NRC.pdf; Author: CERN DEM JLC; CreateDate: 2007-12-03; LatestRevisionDate: 2008-03-13